# Altium project H&S_FreqResp.PrjPcb
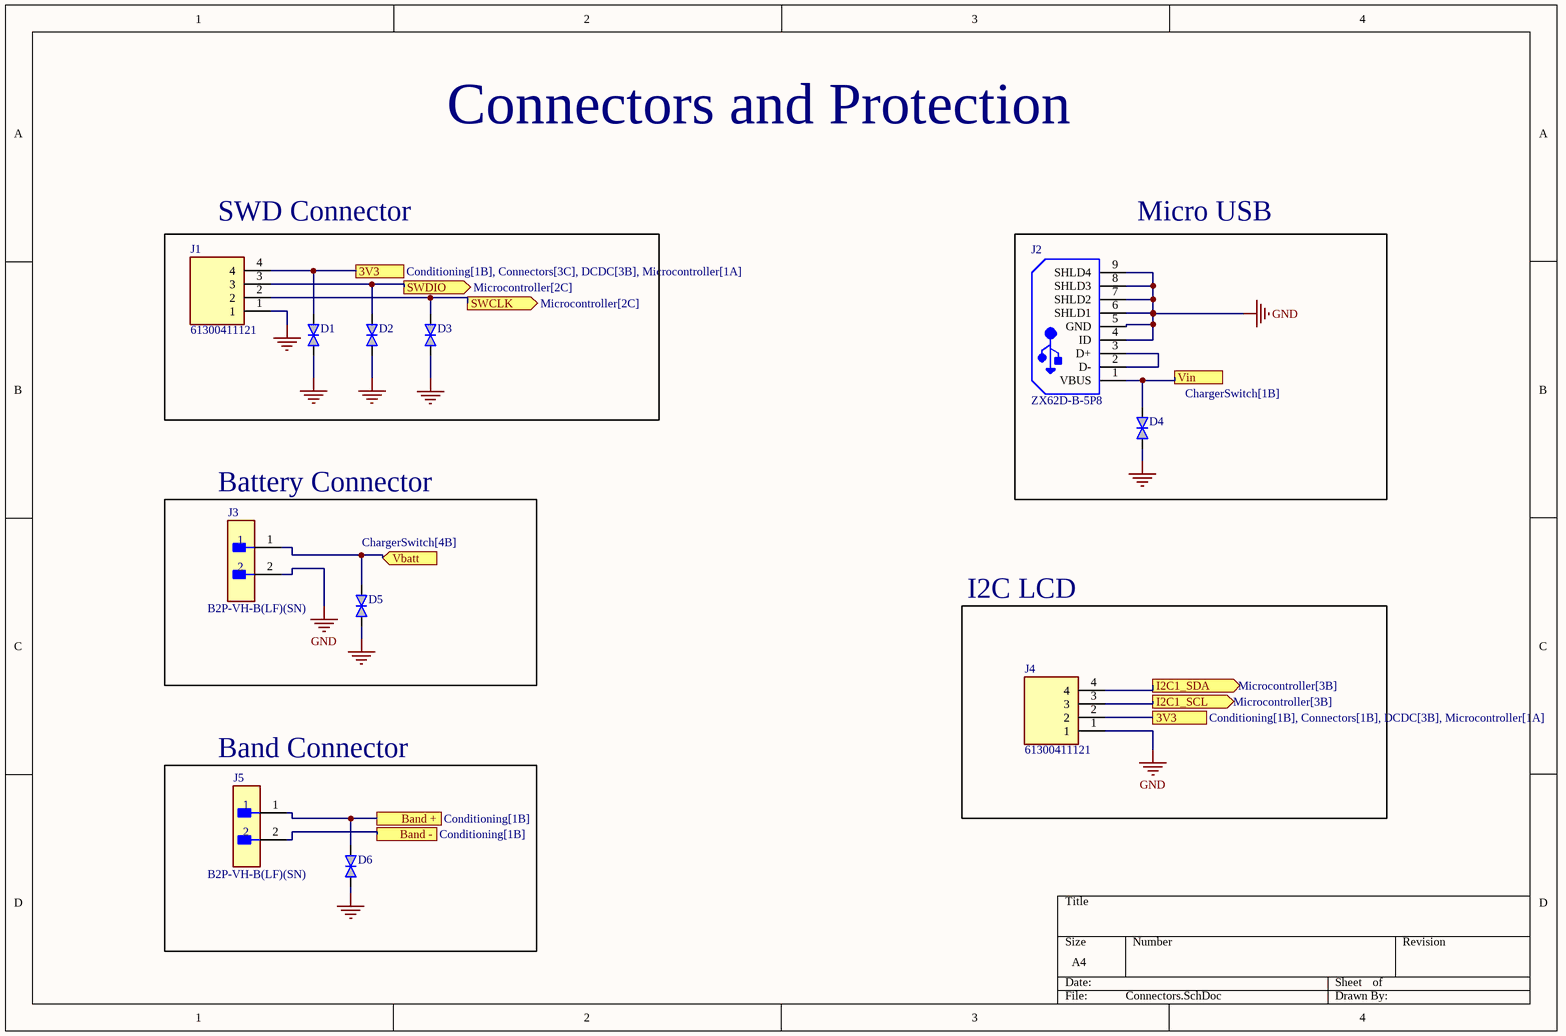
[diagram p0: Connectors.SchDoc]
5 sheets, 67 parts. Net scope: flat (ports and power ports of the same name join across sheets).
Board file: PCB_FreqResp.PcbDoc
Sheets:
  Connectors.SchDoc
  ChargerSwitch.SchDoc
  DCDC.SchDoc
  Conditioning.SchDoc
  Microcontroller.SchDoc

## Sheet Connectors.SchDoc
size A4; SheetNumber: 1; SheetTotal: 5

### Parts
D1  C484328  [1SS357TPH3F]  (value not drawn)
D2  C484328  [1SS357TPH3F]  (value not drawn)
D3  C484328  [1SS357TPH3F]  (value not drawn)
D4  C484328  [1SS357TPH3F]  (value not drawn)
D5  C484328  [1SS357TPH3F]  (value not drawn)
D6  C484328  [1SS357TPH3F]  (value not drawn)
J1  61300411121  [HDRV4W95P0X254_1X4_1016X254X854P]
J2  ZX62D-B-5P8  [HIRO-ZX62D-B-5P8_V]
J3  B2P-VH-B(LF)(SN)  [FP-B2P-VH-B_LF_SN-MFG]
J4  61300411121  [HDRV4W95P0X254_1X4_1016X254X854P]
J5  B2P-VH-B(LF)(SN)  [FP-B2P-VH-B_LF_SN-MFG]

### Blocks framed on the sheet
SWD Connector: D1-D3 J1
Micro USB: D4 J2
Battery Connector: D5 J3
I2C LCD: J4
Band Connector: D6 J5

### Ports
3V3 (see Conditioning[1B], Connectors[1B], DCDC[3B], Microcontroller[1A]), 3V3 (see Conditioning[1B], Connectors[3C], DCDC[3B], Microcontroller[1A]), Band + (see Conditioning[1B]), Band - (see Conditioning[1B]), I2C1_SCL (out, see Microcontroller[3B]), I2C1_SDA (out, see Microcontroller[3B]), SWCLK (out, see Microcontroller[2C]), SWDIO (out, see Microcontroller[2C]), Vbatt (in, see ChargerSwitch[4B]), Vin (see ChargerSwitch[1B])

### Nets
GND: D1.2 D2.2 D3.2 D4.2 D5.2 D6.2 J1.1 J2.4(ID) J2.5(GND) J2.6(SHLD1) J2.7(SHLD2) J2.8(SHLD3) J2.9(SHLD4) J3.2 J4.1 J5.2 ; port Band -
3V3: D1.1 J1.4 J4.2 ; port 3V3
Band +: D6.1 J5.1 ; port Band +
Vbatt: D5.1 J3.1 ; port Vbatt
Vin: D4.1 J2.1(VBUS) ; port Vin
NetD2_1: D2.1 J1.3 ; port SWDIO
NetD3_1: D3.1 J1.2 ; port SWCLK
NetJ2_2: J2.2(D-) J2.3(D+)
NetJ4_3: J4.3 ; port I2C1_SCL
NetJ4_4: J4.4 ; port I2C1_SDA

### Notes on the sheet
- Connectors and Protection

### Library data of the parts
D1-D6 = CMP-004-00033-2: 13.3V 19V 12V SOD-323  ESD Protection Devices ROHS; Manufacturer_Name: Toshiba; Mouser Price/Stock: https://www.mouser.co.uk/ProductDetail/Toshiba/DF2B36FUH3F?qs=PDgMCp4xDJY7HvoH3U6rfA%3D%3D; Design Item ID: DF2B36FU,H3F; Manufacturer_Part_Number: DF2B36FU,H3F; Height: 1mm; Mouser Part Number: 757-DF2B36FUH3F; Source: SamacSys.SchLib; Datasheet Link: http://toshiba.semicon-storage.com/info/docget.jsp?did=36248&prodName=DF2B36FU; Arrow Part Number: DF2B36FU,H3F; Arrow Price/Stock: https://www.arrow.com/en/products/df2b36fuh3f/toshiba?region=nac
J1 = CMP-002-00071-5: WR-PHD 2.54mm Pin Header THT Straight 4p Wurth Elektronik WR-PHD Series, Series Number 6130, 2.54mm Pitch 4 Way 1 Row Straight PCB Header, Solder Termination; Geometry.Height: 8.54mm; Datasheet Link: http://katalog.we-online.de/em/datasheet/6130xx11121.pdf; Manufacturer_Part_Number: 61300411121; Design Item ID: 61300411121; Source: 61300411121.SchLib; Manufacturer_Name: Wurth Elektronik; Mouser Price/Stock: https://www.mouser.co.uk/ProductDetail/Wurth-Elektronik/61300411121?qs=PhR8RmCirEYQcLLqXD8rAA%3D%3D; Mouser Part Number: 710-61300411121
J2 = CMP-002-00043-2: Right Angle Receptacle Connector, Micro USB, 5 Position, Height 2.65 mm, -30 to 85 degC, RoHS, Tape and Reel; Manufacturer: Hirose Electric; Gender: Male; Rows: 1; Current Rating: 1A; Max Operating Temperature: 85°C; Package Quantity: 2000; Connector Type: USB; Datasheet Version: Aug-16; Contact Material: Copper; Packaging: TapeandReel; Package URL: https://www.hirose.com/product/en/download_file/key_name/ZX62D-B-5P8/category/Drawing%20(2D)/doc_file_id/36535/?file_category_id=6&item_id=02420034000&is_series=; Min Operating Temperature: -30°C; Case/Package: ZX62D-B-5P8; Package Reference: ZX62D-B-5P8; Pins: 5; Mounting Technology: SM; Package Description: USB Connector, 5 Position Surface Mount, Length 8 mm, Height 2.65 mm; Housing Material: Plastic; Datasheet URL: https://www.hirose.com/product/en/download_file/key_name/ZX62D-B-5P8/category/Catalog/doc_file_id/31704/?file_category_id=5&item_id=02420034000&is_series=; Contact Plating: Gold; Lead Pitch: 0.65mm; RoHS Compliant: True; Manufacturer URL: https://www.hirose.com
J3 J5 = CMP-17439-000297-1: CONN HEADER VERT 2POS 3.96MM; Number of Positions: 2; Pitch: 0.156inch; Voltage Rating: 250V; Termination: Solder; Lead Free: Lead Free; Insulation Color: Natural; Contact Material: Brass; Flammability Rating: UL94 V-0; Packaging: Bulk; Contact Mating Length: 0.303inch; Color: Natural; Contact Shape: Square; Contact Plating: Tin; Number of Rows: 1; Insulation Material: PBT; Connector Type: Header; Contact Finish - Mating: TIN; Mount: Through Hole; Fastening Type: Friction; Contact Type: Male Pin; Series: VH
J4 = CMP-002-00071-1: WR-PHD 2.54mm Pin Header THT Straight 4p Wurth Elektronik WR-PHD Series, Series Number 6130, 2.54mm Pitch 4 Way 1 Row Straight PCB Header, Solder Termination; Geometry.Height: 8.54mm; Design Item ID: 61300411121; Datasheet Link: http://katalog.we-online.de/em/datasheet/6130xx11121.pdf; Source: 61300411121.SchLib; Manufacturer_Part_Number: 61300411121; Mouser Price/Stock: https://www.mouser.co.uk/ProductDetail/Wurth-Elektronik/61300411121?qs=PhR8RmCirEYQcLLqXD8rAA%3D%3D; Manufacturer_Name: Wurth Elektronik; Mouser Part Number: 710-61300411121

## Sheet ChargerSwitch.SchDoc
size A4; SheetNumber: 2; SheetTotal: 5
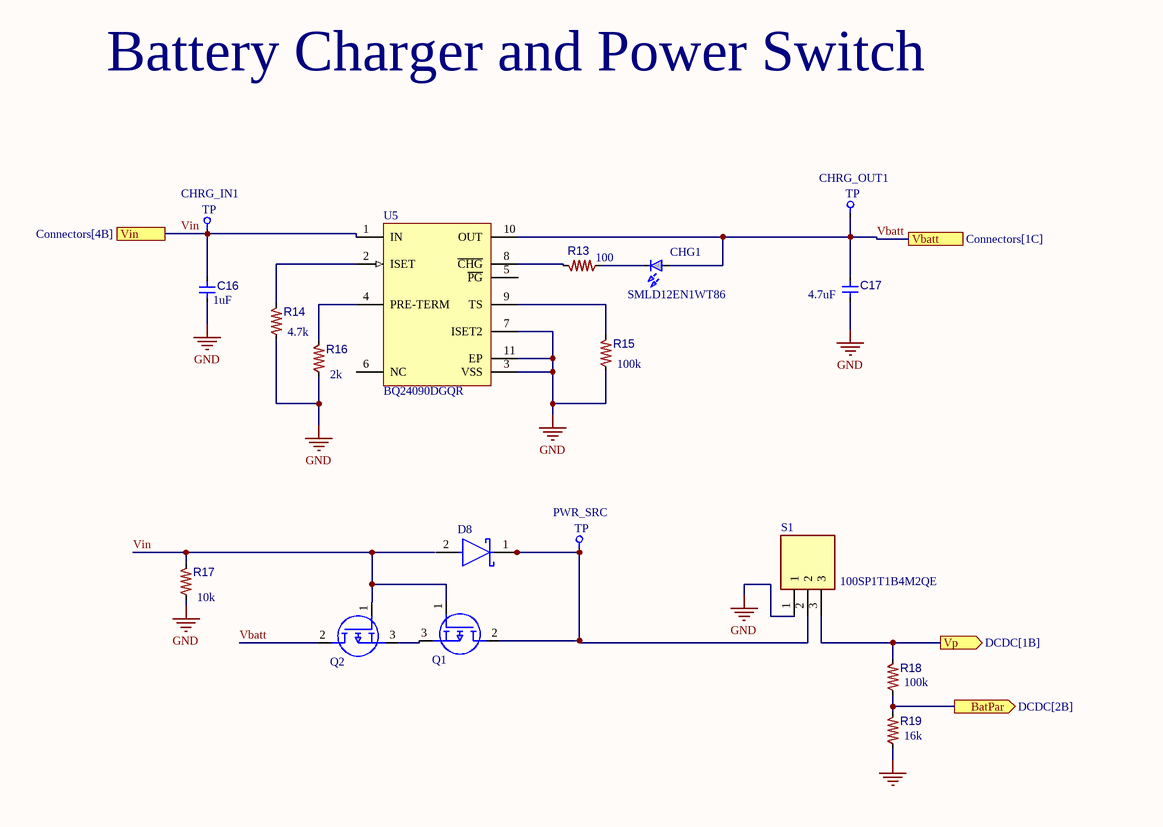
[diagram p1: ChargerSwitch.SchDoc]

### Parts
C16  C309479  [New footprint 1]  (value not drawn)
C17  C77045  [New footprint 1]  (value not drawn)
CHG1  SMLD12EN1WT86  [LEDM168X65N]
CHRG_IN1  Test Pad  [Test Pad-Footprint-1]  (value not drawn)
CHRG_OUT1  Test Pad  [Test Pad-Footprint-1]  (value not drawn)
D8  C191986  [FP-MBR1020VL_R1_00001-MFG]  (value not drawn)
PWR_SRC  Test Pad  [Test Pad-Footprint-1]  (value not drawn)
Q1  C113491  [TSM260P02CXRFG]  (value not drawn)
Q2  C113491  [TSM260P02CXRFG]  (value not drawn)
R13  C176127  [0603 resistor-Footprint-1]  (value not drawn)
R14  C116693  [0603 resistor-Footprint-1]  (value not drawn)
R15  C153133  [0603 resistor-Footprint-1]  (value not drawn)
R16  C105576  [0603 resistor-Footprint-1]  (value not drawn)
R17  C103210  [0603 resistor-Footprint-1]  (value not drawn)
R18  C153133  [0603 resistor-Footprint-1]  (value not drawn)
R19  C153133  [0603 resistor-Footprint-1]  (value not drawn)
S1  100SP1T1B4M2QE  [100SP1T1B4M2QE]
U5  BQ24090DGQR  [DGQ0010D_L]

### Ports
BatPar (out, see DCDC[2B]), Vbatt (see Connectors[1C]), Vin (see Connectors[4B]), Vp (out, see DCDC[1B])

### Nets
GND: C16.1 C17.1 R14.2 R15.2 R16.2 R17.2 R19.2 S1.1 U5.3(VSS) U5.7(ISET2) U5.11(EP)
Vbatt: C17.2 CHG1.2(A) CHRG_OUT1.1 Q2.2(D) U5.10(OUT) ; port Vbatt
Vin: C16.2 CHRG_IN1.1 Q1.1(G) Q2.1(G) R17.1 U5.1(IN) ; port Vin
NetC4_2: R18.1 S1.3 ; port Vp
NetCHG1_1: CHG1.1(K) R13.2
NetD8_1: D8.1(C) PWR_SRC.1 Q1.2(D) S1.2
NetQ1_3: Q1.3(S) Q2.3(S)
NetR13_1: R13.1 U5.8(~{CHG})
NetR14_1: R14.1 U5.2(ISET)
NetR15_1: R15.1 U5.9(TS)
NetR16_1: R16.1 U5.4(PRE-TERM)
NetR18_2: R18.2 R19.1 ; port BatPar

Not connected (* = marked no-connect by the designer): D8 2(A); U5 5(~{PG}) 6(NC)

### Notes on the sheet
- Battery Charger and Power Switch
- (near R13) 100
- (near C16) 1uF
- 4.7k
- (near C17) 4.7uF
- (near R16) 2k
- (near R15) 100k
- (near R17) 10k
- (near R18) 100k
- (near R19) 16k
- (in symbol CMP-00030-00001-1) TP

### Library data of the parts
C16 = CMP-001-00083-1: 6.3V 1uF X7R ±10% 0603  Multilayer Ceramic Capacitors MLCC - SMD/SMT ROHS
C17 = CMP-001-00083-1: 116V 4.7uF X5R ±10% 0603 Multilayer Ceramic Capacitors MLCC - SMD/SMT ROHS
CHG1 = CMP-004-00034-1: Standard LEDs - SMD 1.6X0.8MM LOW CRNT; Manufacturer_Name: ROHM Semiconductor; Geometry.Height: 0.65mm; Datasheet Link: https://datasheet.datasheetarchive.com/originals/distributors/Datasheets_SAMA/8f824a900f8c9a143b1c3640e6aee7b7.pdf; Design Item ID: SMLD12EN1WT86; Manufacturer_Part_Number: SMLD12EN1WT86; Mouser Price/Stock: https://www.mouser.co.uk/ProductDetail/ROHM-Semiconductor/SMLD12EN1WT86?qs=qSfuJ%252Bfl%2Fd4fR%252B9yZydIwg%3D%3D; Mouser Part Number: 755-SMLD12EN1WT86; Source: SMLD12EN1WT86.SchLib
CHRG_IN1 CHRG_OUT1 PWR_SRC = CMP-00030-00001-1
D8 = CMP-34900-000005-1: 20V 340mV@1A 1A SOD-123F  Schottky Barrier Diodes (SBD) ROHS; RoHS Compliant: Yes
Q1 Q2 = CMP-010-000000-2: 20V 6.5A 1.4W 27mΩ@4.5V,6.5A N Channel SOT-23(TO-236)  MOSFETs ROHS; Manufacturer_Part_Number: TSM260P02CX RFG; Manufacturer_Name: Taiwan Semiconductor; Geometry.Height: 1.45mm; Mouser Price/Stock: https://www.mouser.co.uk/ProductDetail/Taiwan-Semiconductor/TSM260P02CX-RFG?qs=BZBei1rCqCB5JwyWPOdghw%3D%3D; Source: TSM260P02CX_RFG.SchLib; Design Item ID: TSM260P02CX_RFG; Datasheet Link: https://www.taiwansemi.com/assets/uploads/datasheet/TSM260P02_D1811.pdf; Mouser Part Number: 821-TSM260P02CXRFG
R13 = CMP-009-00177-1: 100mW Thick Film Resistors ±100ppm/℃ ±1% 100Ω 0603 Chip Resistor - Surface Mount ROHS
R14 = CMP-009-00177-1: 100mW ±100ppm/℃ ±1% 4.7kΩ 0603 Chip Resistor - Surface Mount ROHS
R15 R18 R19 = CMP-009-00177-1: 100mW Thick Film Resistors ±5% ±200ppm/℃ 100kΩ 0603 Chip Resistor - Surface Mount ROHS
R16 = CMP-009-00177-1: 100mW Thick Film Resistors ±100ppm/℃ ±1% 2kΩ 0603 Chip Resistor - Surface Mount ROHS
R17 = CMP-009-00177-1: 100mW Thick Film Resistors ±100ppm/℃ ±5% 10kΩ 0603 Chip Resistor - Surface Mount ROHS
S1 = CMP-011-00013-1: E-SWITCH - 100SP1T1B4M2QE - SWITCH; Datasheet Link: http://spec_sheets.e-switch.com/specs/T111597.pdf; Design Item ID: 100SP1T1B4M2QE; Height: 28mm; Mouser Part Number: 612-100-A1421; Source: SamacSys.SchLib; Manufacturer_Name: E-Switch; Mouser Price/Stock: https://www.mouser.co.uk/ProductDetail/E-Switch/100SP1T1B4M2QE?qs=YXf4ACKMM4xJ0mJK%2FyIa1g%3D%3D; Manufacturer_Part_Number: 100SP1T1B4M2QE
U5 = CMP-0321-00917-2: 6.45V 锂离子/Polymer 1 1A MSOP-10-EP  Battery Management ICs ROHS; Manufacturer: Texas Instruments; Over Voltage Protection: N; Eco-Plan: Green (RoHS & no Sb/Br); SubFamily: Battery Charge Management; Vin(Min)(V): 4.5; ComponentLink1URL: http://www.ti.com/general/docs/lit/getliterature.tsp?genericPartNumber=BQ24090&fileType=pdf; Lead Acid: N; PackageVersion: revF, Nov-2011; PackageReference: DGQ0010D; NiMH: N; Code_JEDEC: MO-187-BA-T; Mounting Technology: Surface Mount; Li-Polymer: N; PackageDescription: 10-Pin PowerPAD Plastic Small Outline 0.5 mm Pitch, Exposed Pad; PartNumber: BQ24090DGQR; NiCd: N; Li-Ion: N; ComponentLink1Description: Datasheet; DatasheetVersion: SLUS968C

## Sheet DCDC.SchDoc
size A4; SheetNumber: 3; SheetTotal: 5
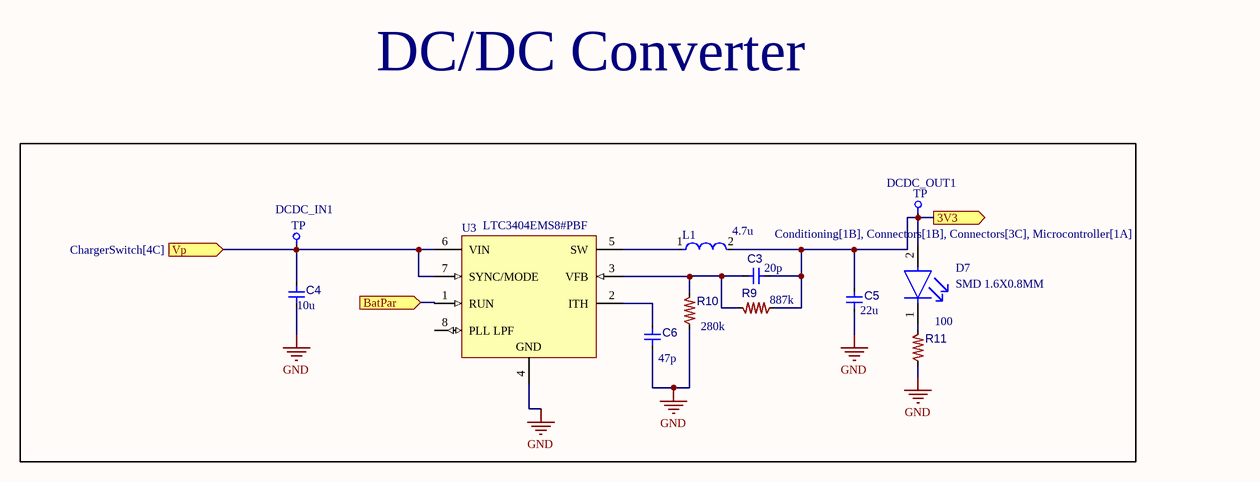
[diagram p2: DCDC.SchDoc]

### Parts
C3  C63680  [New footprint 1]  (value not drawn)
C4  C90806  [New footprint 1]  (value not drawn)
C5  C93926  [New footprint 1]  (value not drawn)
C6  C113801  [New footprint 1]  (value not drawn)
D7  SMD 1.6X0.8MM  [FP-APT1608LZGCK-MFG]
DCDC_IN1  Test Pad  [Test Pad-Footprint-1]  (value not drawn)
DCDC_OUT1  Test Pad  [Test Pad-Footprint-1]  (value not drawn)
L1  C340379  [FP-SRN4018-MFG]  (value not drawn)
R9  C403386  [0603 resistor-Footprint-1]  (value not drawn)
R10  C100930  [0603 resistor-Footprint-1]  (value not drawn)
R11  C176127  [0603 resistor-Footprint-1]  (value not drawn)
U3  LTC3404EMS8#PBF  [LT-MS8_L]

### Ports
3V3 (out, see Conditioning[1B], Connectors[1B], Connectors[3C], Microcontroller[1A]), BatPar (in, see ChargerSwitch[4D]), Vp (in, see ChargerSwitch[4C])

### Nets
GND: C4.1 C5.1 C6.1 R10.2 R11.2 U3.4(GND)
3V3: C3.2 C5.2 D7.2(A) DCDC_OUT1.1 L1.2 R9.2 ; port 3V3
NetC3_1: C3.1 R9.1 R10.1 U3.3(VFB)
NetC4_2: C4.2 DCDC_IN1.1 U3.6(VIN) U3.7(SYNC/MODE) ; port Vp
NetC6_2: C6.2 U3.2(ITH)
NetD7_1: D7.1(C) R11.1
NetL1_1: L1.1 U3.5(SW)
NetR18_2: U3.1(RUN) ; port BatPar

Not connected (* = marked no-connect by the designer): U3 8(PLL_LPF)

### Notes on the sheet
- DC/DC Converter
- (near L1) 4.7u
- (near C4) 10u
- (near C3) 20p
- (near R9) 887k
- (near C5) 22u
- (near C6) 47p
- (near R10) 280k
- 100
- (in symbol CMP-00030-00001-1) TP

### Library data of the parts
C3 = CMP-001-00083-1: 200V 20pF C0G ±5% 0603 Multilayer Ceramic Capacitors MLCC - SMD/SMT ROHS
C4 = CMP-001-00083-1: 10V 10uF X5R ±10% 0603 Multilayer Ceramic Capacitors MLCC - SMD/SMT ROHS
C5 = CMP-001-00083-1: 6.3V 22uF X5R ±20% 0603 Multilayer Ceramic Capacitors MLCC - SMD/SMT ROHS
C6 = CMP-001-00083-1: 250V 47pF NP0 ±5% 0603 Multilayer Ceramic Capacitors MLCC - SMD/SMT ROHS
D7 = CMP-44529-000040-1: Standard LEDs - SMD 1.6X0.8MM LOW CRNT; Dominant Wavelength: 525nm; Forward Voltage: 2.65V; Lens Transparency: Clear; Luminous Intensity: 50mcd; Test Current: 2mA; Viewing Angle: 120°; Color: Green; Lens Color: Colorless; Width: 0.8mm; Mount: Surface Mount; Length: 1.6mm; Packaging: Cut Tape; Case Code (Metric): 1608; Height: 0.75mm; Case/Package: 0603; Case Code (Imperial): 0603
DCDC_IN1 DCDC_OUT1 = CMP-00030-00001-1
L1 = CMP-07248-000014-1: 1.9A 4.7uH ±20% 2A SMD,4x4mm  Power Inductors ROHS; Manufacturer Part Number: SRN4018-4R7M; Manufacturer: Bourns; Q Factor: 9; Series Resistance: 0.084Ω; Test Frequency: 7.96MHz; Self Resonant Frequency: 35MHz; Core Material: Ferrite; Shielding: true; Lead Free: Yes; Rms Current: 1.9A; Temperature: -40°C to +125°C; Value: 4.7uH; Inductance: 4.7uH; Device Class L1: Passive Components; Automotive: No; Octopart: https://octopart.com/srn4018-4r7m-bourns-25452396; Tolerance: 20%; Mouser Description: Fixed Inductors 4.7uH 20% SMD 4018; Package: SRN4018; Height: 1.8mm; Device Class L3: Fixed Inductors; ComponentLink2Description: Datasheet; Composition: Wirewound; Category: Ind; RoHS: TRUE; ComponentLink2URL: https://www.bourns.com/docs/Product-Datasheets/SRN4018.pdf; Temperature Range High: +125°C; Temperature Range Low: -40°C; Digikey Description: FIXED IND 4.7UH 1.9A 84 MOHM SMD; Saturation Current: 2A; Device Class L2: Inductors
R9 = CMP-009-00177-1: 100mW Thick Film Resistors ±100ppm/℃ ±1% 887000Ω 0603 Chip Resistor - Surface Mount ROHS
R10 = CMP-009-00177-1: 100mW Thick Film Resistors ±100ppm/℃ ±1% 280kΩ 0603 Chip Resistor - Surface Mount ROHS
R11 = CMP-009-00177-1: as R13 on sheet ChargerSwitch
U3 = CMP-0492-01333-1: Step-down type Adjustable 600mA 2.65V~6V 0.8V~6V MSOP-8  DC-DC Converters ROHS; Manufacturer: Linear Technology; Frequency Sync Range: 1MHz - 1.7MHz; Number of Outputs: 1; ComponentLink3Description: Package Specification; ComponentLink1URL: http://www.linear.com/; PackageVersion: Rev. G, 05/2013; PackageReference: MS8; ComponentLink1Description: Manufacturer URL; ComponentLink2Description: Datasheet; PackageDescription: 8-Pin Plastic MSOP, Body 3 x 3 mm, Pitch 0.65 mm; DatasheetVersion: Rev. B; RoHS: TRUE; ComponentLink2URL: http://cds.linear.com/docs/en/datasheet/3404fb.pdf; PartNumber: LTC3404EMS8#PBF; ComponentLink3URL: http://cds.linear.com/docs/en/packaging/05081660_G_MS8.pdf; Mounting Technology: Surface Mount

## Sheet Conditioning.SchDoc
size A4; SheetNumber: 4; SheetTotal: 5
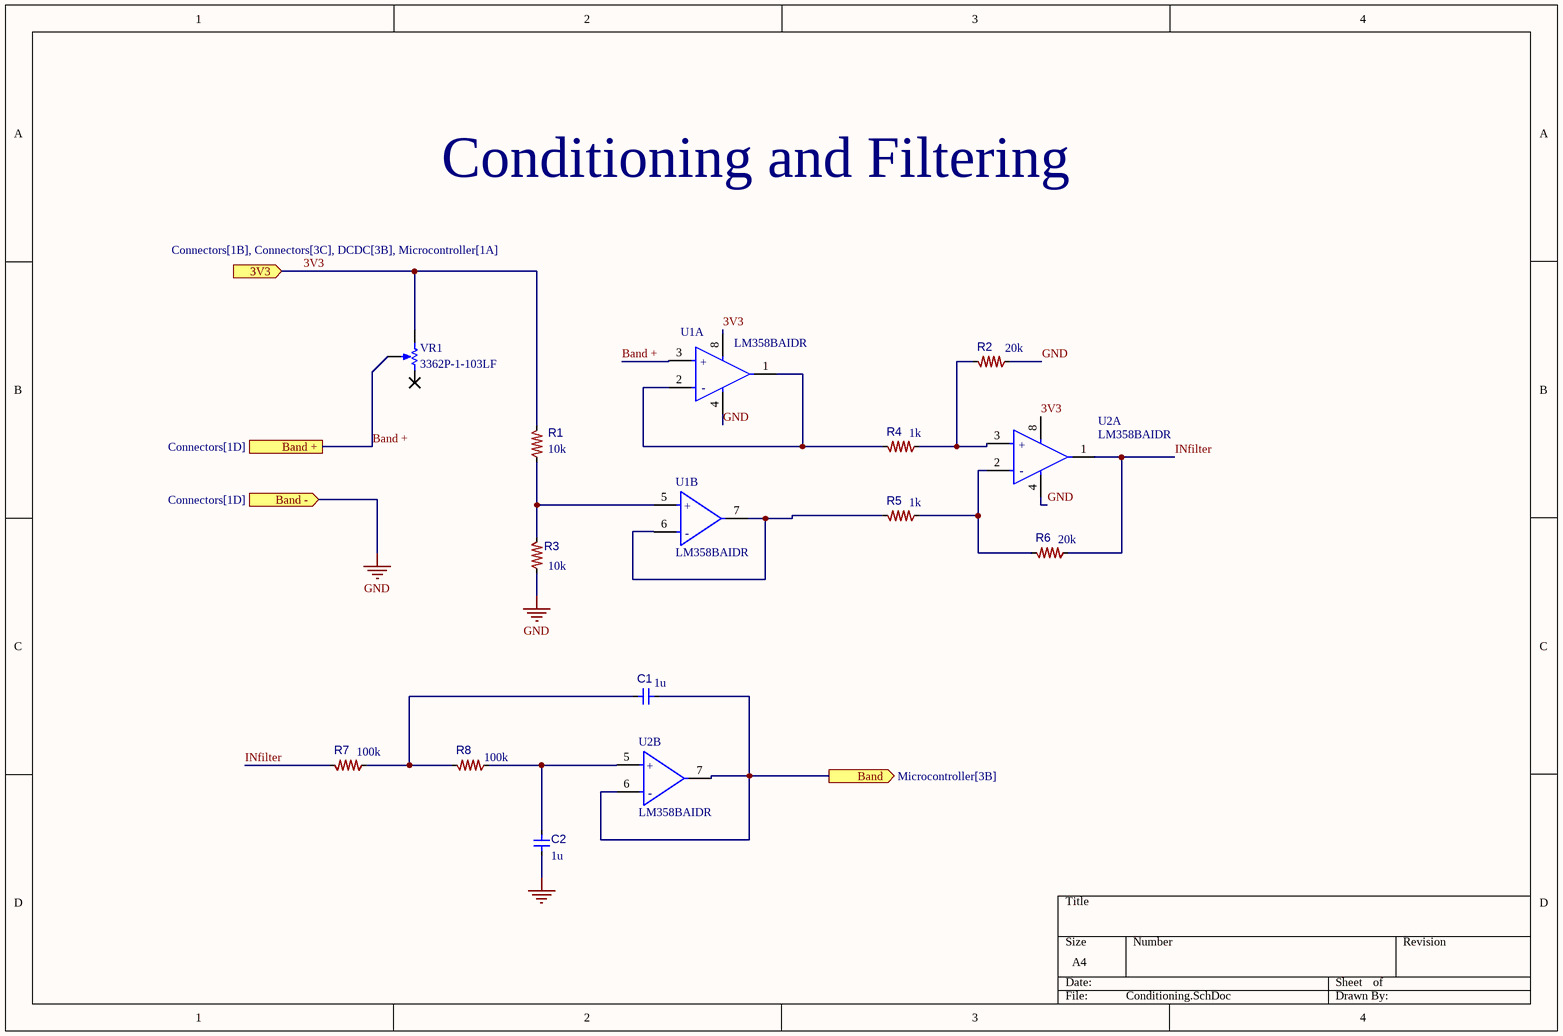
[diagram p3: Conditioning.SchDoc]

### Parts
C1  C309479  [New footprint 1]  (value not drawn)
C2  C309479  [New footprint 1]  (value not drawn)
R1  C103210  [0603 resistor-Footprint-1]  (value not drawn)
R2  (no value)  [0603 resistor-Footprint-1]
R3  C103210  [0603 resistor-Footprint-1]  (value not drawn)
R4  C103198  [0603 resistor-Footprint-1]  (value not drawn)
R5  C103198  [0603 resistor-Footprint-1]  (value not drawn)
R6  (no value)  [0603 resistor-Footprint-1]
R7  C153133  [0603 resistor-Footprint-1]  (value not drawn)
R8  C153133  [0603 resistor-Footprint-1]  (value not drawn)
U1  LM358BAIDR  [FP-D0008A-IPC_A]  (parts A,B of 2)
U2  LM358BAIDR  [FP-D0008A-IPC_A]  (parts A,B of 2)
VR1  3362P-1-103LF  [BOUR-3362P]

### Ports
3V3 (in, see Connectors[1B], Connectors[3C], DCDC[3B], Microcontroller[1A]), Band (out, see Microcontroller[3B]), Band + (see Connectors[1D]), Band - (in, see Connectors[1D])

### Nets
GND: C2.1 R2.2 R3.2 U1.4(V-) U2.4(V-) ; port Band -
3V3: R1.1 U1.8(V+) U2.8(V+) VR1.1(CCW) ; port 3V3
Band +: U1.3(IN1+) VR1.2(S) ; port Band +
INfilter: R6.2 R7.1 U2.1(OUT1)
NetC1_1: C1.1 R7.2 R8.1
NetC1_2: C1.2 U2.6(IN2-) U2.7(OUT2) ; port Band
NetC2_2: C2.2 R8.2 U2.5(IN2+)
NetR1_2: R1.2 R3.1 U1.5(IN2+)
NetR2_1: R2.1 R4.2 U2.3(IN1+)
NetR4_1: R4.1 U1.1(OUT1) U1.2(IN1-)
NetR5_1: R5.1 U1.7(OUT2)
NetR5_2: R5.2 R6.1 U2.2(IN1-)

Not connected (* = marked no-connect by the designer): U1 6(IN2-); VR1 3(CW)

### Notes on the sheet
- Conditioning and Filtering
- (near R2) 20k
- (near R1) 10k
- (near R4) 1k
- (near R5) 1k
- (near R3) 10k
- (near R6) 20k
- (near C1) 1u
- (near R7) 100k
- (near R8) 100k
- (near C2) 1u
- (in symbol CMP-04895-000406-1, part A) +; -
- (in symbol CMP-04895-000406-1, part B) +; -

### Library data of the parts
C1 C2 = CMP-001-00083-1: as C16 on sheet ChargerSwitch
R1 R3 = CMP-009-00177-1: as R17 on sheet ChargerSwitch
R2 R6 = CMP-009-00177-1
R4 R5 = CMP-009-00177-1: 100mW ±100ppm/℃ ±1% 1kΩ 0603  Chip Resistor - Surface Mount ROHS
R7 R8 = CMP-009-00177-1: as R15 on sheet ChargerSwitch
U1 U2 = CMP-04895-000406-1: SOP-8  Operational Amplifier ROHS
VR1 = CMP-009-00039-3: ±10% ±100ppm/℃ 500mW 10kΩ Plugin  Variable Resistors/Potentiometers ROHS; Manufacturer: Bourns; Resistance: 10k; Voltage Rating: 300V; Package Description: 3-Pin Through Hole Device, Body 6.6 x 6.99 mm, Pitch 2.54 mm; Tolerance: 10%; Case/Package: 3326P; Composition: Potentiometer di LUCA; Packaging: Rail/Tube; Package Reference: 3326P; Power: 500mW; RoHS Compliant: True; Package Quantity: 250; Pins: 3; Lead Pitch: 2.54mm

## Sheet Microcontroller.SchDoc
size A4; SheetNumber: 5; SheetTotal: 5
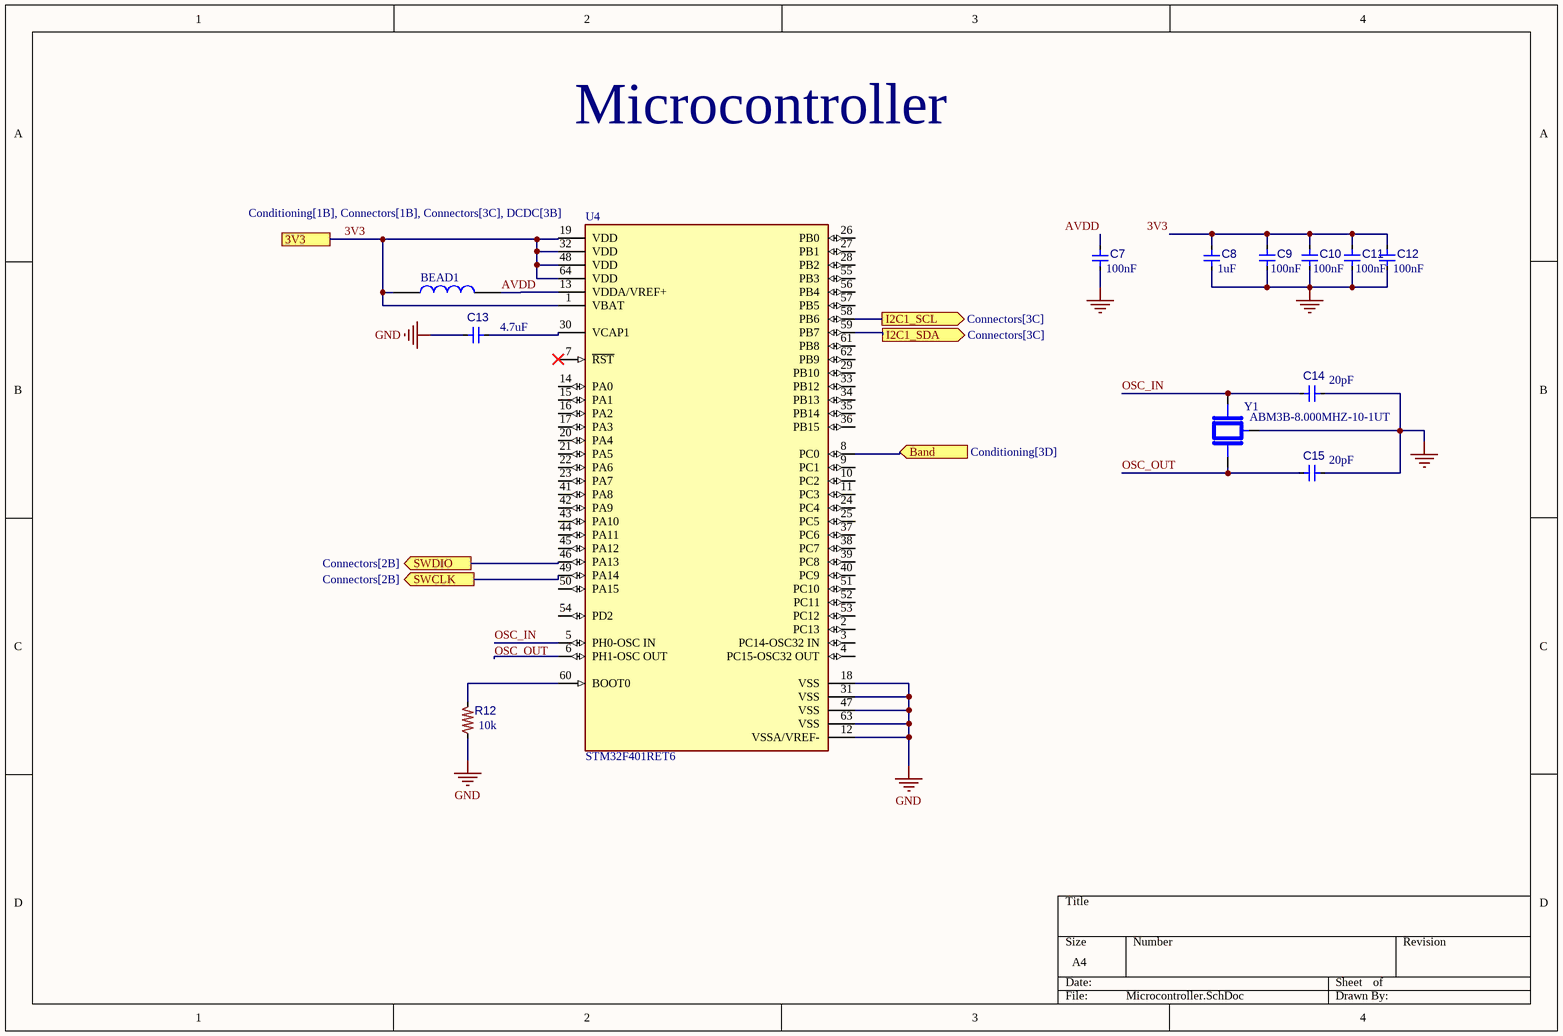
[diagram p4: Microcontroller.SchDoc]

### Parts
BEAD1  C710390  [BEADC1608X95N]  (value not drawn)
C7  C105907  [New footprint 1]  (value not drawn)
C8  C309479  [New footprint 1]  (value not drawn)
C9  C105907  [New footprint 1]  (value not drawn)
C10  C105907  [New footprint 1]  (value not drawn)
C11  C105907  [New footprint 1]  (value not drawn)
C12  C105907  [New footprint 1]  (value not drawn)
C13  C77045  [New footprint 1]  (value not drawn)
C14  C63680  [New footprint 1]  (value not drawn)
C15  C63680  [New footprint 1]  (value not drawn)
R12  C103210  [0603 resistor-Footprint-1]  (value not drawn)
U4  STM32F401RET6  [FP-LQFP64-5W-MFG]
Y1  ABM3B-8.000MHZ-10-1UT  [XTAL_ABM3B-8.000MHZ-10-1UT]

### Ports
3V3 (see Conditioning[1B], Connectors[1B], Connectors[3C], DCDC[3B]), Band (in, see Conditioning[3D]), I2C1_SCL (out, see Connectors[3C]), I2C1_SDA (out, see Connectors[3C]), SWCLK (out, see Connectors[2B]), SWDIO (out, see Connectors[2B])

### Nets
GND: C7.1 C8.1 C9.1 C10.1 C13.1 C14.2 C15.2 R12.2 U4.12(VSSA/VREF-) U4.18(VSS) U4.31(VSS) U4.47(VSS) U4.63(VSS) Y1.4
3V3: BEAD1.1 C8.2 C9.2 C10.2 C11.2 C12.2 U4.1(VBAT) U4.19(VDD) U4.32(VDD) U4.48(VDD) U4.64(VDD) ; port 3V3
AVDD: BEAD1.2 C7.2 U4.13(VDDA/VREF+)
OSC_IN: C14.1 U4.5(PH0-OSC_IN) Y1.3
OSC_OUT: C15.1 U4.6(PH1-OSC_OUT) Y1.1
NetC1_2: U4.8(PC0) ; port Band
NetC11_1: C11.1 C12.1
NetC13_2: C13.2 U4.30(VCAP1)
NetD2_1: U4.46(PA13) ; port SWDIO
NetD3_1: U4.49(PA14) ; port SWCLK
NetJ4_3: U4.58(PB6) ; port I2C1_SCL
NetJ4_4: U4.59(PB7) ; port I2C1_SDA
NetR12_1: R12.1 U4.60(BOOT0)

Not connected (* = marked no-connect by the designer): U4 2(PC13) 3(PC14-OSC32_IN) 4(PC15-OSC32_OUT) 7(~{RST})* 9(PC1) 10(PC2) 11(PC3) 14(PA0) 15(PA1) 16(PA2) 17(PA3) 20(PA4) 21(PA5) 22(PA6) 23(PA7) 24(PC4) 25(PC5) 26(PB0) 27(PB1) 28(PB2) 29(PB10) 33(PB12) 34(PB13) 35(PB14) 36(PB15) 37(PC6) 38(PC7) 39(PC8) 40(PC9) 41(PA8) 42(PA9) 43(PA10) 44(PA11) 45(PA12) 50(PA15) 51(PC10) 52(PC11) 53(PC12) 54(PD2) 55(PB3) 56(PB4) 57(PB5) 61(PB8) 62(PB9)

### Notes on the sheet
- Microcontroller
- (near C7) 100nF
- (near C8) 1uF
- (near C9) 100nF
- (near C10) 100nF
- 100nF
- (near C12) 100nF
- (near C13) 4.7uF
- (near C14) 20pF
- (near C15) 20pF
- (near R12) 10k

### Library data of the parts
BEAD1 = CMP-038-000000-3: MURATA Ferrite Beads 120 OHM - BLM18SG121TZ1D; Manufacturer_Name: Walsin Technology Corporation; Geometry.Height: 0.95mm; Mouser Price/Stock: https://www.mouser.co.uk/ProductDetail/Walsin/WLBD1608K1U601TB/?qs=ZrPdAQfJ6DPLMgkQk27DNg%3D%3D; Mouser Part Number: 791-WLBD1608K1U601TB; Design Item ID: WLBD1608K1U601TB; Datasheet Link: https://www.mouser.fr/datasheet/2/210/kamaya_watc-s-a0003407801-1-1749693.pdf; Source: WLBD1608K1U601TB.SchLib; Manufacturer_Part_Number: WLBD1608K1U601TB
C7 C9-C12 = CMP-001-00083-1: 100V 100nF X7R ±10% 0603  Multilayer Ceramic Capacitors MLCC - SMD/SMT ROHS
C8 = CMP-001-00083-1: as C16 on sheet ChargerSwitch
C13 = CMP-001-00083-1: as C17 on sheet ChargerSwitch
C14 C15 = CMP-001-00083-1: as C3 on sheet DCDC
R12 = CMP-009-00177-1: as R17 on sheet ChargerSwitch
U4 = CMP-12105-000004-1: 512KB 1.7V~3.6V ARM Cortex-M4 84MHz 50 LQFP-64(10x10)  Microcontroller Units (MCUs/MPUs/SOCs) ROHS; Manufacturer: STMicroelectronics; Memory Size: 512KBytes; Number Of Cores: 1; Max Junction Temp: +105°C; Ram Size: 96KBytes; Number Of Adc Channels: 12; Number Of Pwm Channels: 23; Standoff Height: 0.05mm; Number Of Timers/Counters: 8; Number Of I/Os: 50; Interface: I2C,SPI,USART,USB,IrDA,I2S,SMBus,Other; Number Of I2C Channels: 3; Max Supply Voltage: 3.6V; Data Bus Width: 32bits; Min Supply Voltage: 1.65V; Memory Type: FLASH; Category: IC; Device Class L3: Microcontrollers; ComponentLink2URL: https://www.st.com/resource/en/datasheet/stm32f401re.pdf; RoHS: TRUE; Temperature Range High: +105°C; Device Class L2: Embedded Processors and Controllers; ComponentLink2Description: Datasheet; Temperature Range Low: -40°C; Digikey Description: IC MCU 32BIT 512KB FLASH 64LQFP; Package: LQFP64-5W; Manufacturer Part Number: STM32F401RET6; Number Of A/D Converters: 1; Frequency: 84MHz; Ipc Land Pattern Name: QFP50P1200X1200X160-64; Automotive: No; Ambient Temperature Range Low: -40°C; Height: 1.6mm; Octopart: https://octopart.com/stm32f401ret6-stmicroelectronics-34185993; Ambient Temperature Range High: +85°C; Device Class L1: Integrated Circuits (ICs); Temperature: -40°C to +105°C; Core Architecture: ARM Cortex-M4; Number Of Spi Channels: 3; Number Of Uart Channels: 3; Number Of Usb Channels: 1; Lead Free: Yes; Mouser Description: ARM Microcontrollers - MCU 16/32-BITS MICROS
Y1 = CMP-003-00030-1: Crystal 8MHz Â±10ppm (Tol) Â±10ppm (Stability) 10pF FUND 200Ohm 4-Pin CSMD T/R; MF: Abracon Corporation; Check_prices: https://www.snapeda.com/parts/ABM3B-8.000MHZ-10-1UT/Abracon/view-part/?ref=eda; Availability: In Stock; Component Type: Standard; Source: ABM3B-8.000MHZ-10-1UT.SchLib; Case/Package: Package; Purchase-URL: https://pricing.snapeda.com/search/part/ABM3B-8.000MHZ-10-1UT/?ref=eda; Value: *; MP: ABM3B-8.000MHZ-10-1UT; Price: None; Design Item ID: ABM3B-8.000MHZ-10-1UT; SnapEDA_Link: https://www.snapeda.com/parts/ABM3B-8.000MHZ-10-1UT/Abracon/view-part/?ref=snap; Pins: 4

## Nets that join several sheets
GND: Connectors (16 pins), ChargerSwitch (11 pins), DCDC (6 pins), Conditioning (5 pins), Microcontroller (14 pins)
3V3: Connectors (D1.1 J1.4 J4.2), DCDC (6 pins), Conditioning (R1.1 U1.8 U2.8 VR1.1), Microcontroller (11 pins)
Band +: Connectors (D6.1 J5.1), Conditioning (U1.3 VR1.2)
NetC1_2: Conditioning (C1.2 U2.6 U2.7), Microcontroller (U4.8)
NetC4_2: ChargerSwitch (R18.1 S1.3), DCDC (C4.2 DCDC_IN1.1 U3.6 U3.7)
NetD2_1: Connectors (D2.1 J1.3), Microcontroller (U4.46)
NetD3_1: Connectors (D3.1 J1.2), Microcontroller (U4.49)
NetJ4_3: Connectors (J4.3), Microcontroller (U4.58)
NetJ4_4: Connectors (J4.4), Microcontroller (U4.59)
NetR18_2: ChargerSwitch (R18.2 R19.1), DCDC (U3.1)
Vbatt: Connectors (D5.1 J3.1), ChargerSwitch (5 pins)
Vin: Connectors (D4.1 J2.1), ChargerSwitch (6 pins)